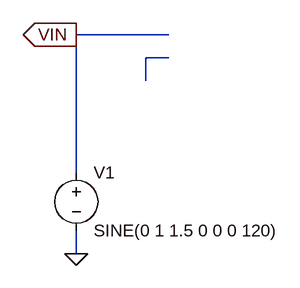
[diagram p0: schematic Draft2.asc]
Draft2.asc, the LTspice schematic file:
Version 4
SHEET 1 880 680
WIRE 48 -48 -80 -48
WIRE 48 -16 16 -16
WIRE 16 16 16 -16
WIRE -80 144 -80 -48
WIRE -80 256 -80 224
FLAG -80 256 0
FLAG -80 -48 VIN
IOPIN -80 -48 Out
SYMBOL voltage -80 128 R0
WINDOW 123 0 0 Left 0
WINDOW 39 0 0 Left 0
SYMATTR InstName V1
SYMATTR Value SINE(0 1 1.5 0 0 0 120)

The netlist it stands for:
* Draft2.asc
V1 VIN 0 SINE(0 1 1.5 0 0 0 120)
.backanno
.end